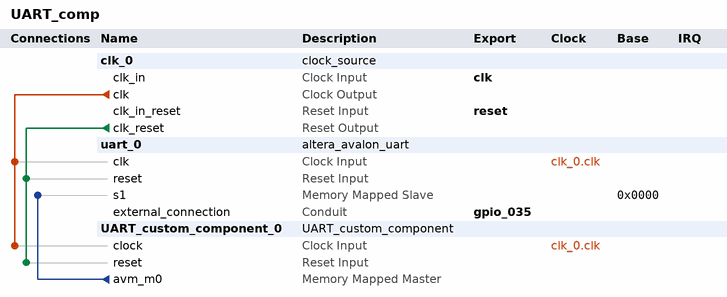
[diagram p0: system contents]
# Platform Designer (Qsys) system UART_comp, Cyclone V 5CSEMA5F31C6
# Parameters at their usual value, and those the tool derives, are not listed.
package require -exact qsys 18.1
create_system UART_comp
set_project_property DEVICE_FAMILY {Cyclone V}
set_project_property DEVICE 5CSEMA5F31C6

add_instance clk_0 clock_source 18.1
set_instance_parameter_value clk_0 clockFrequency 50000000

add_instance uart_0 altera_avalon_uart 18.1
set_instance_parameter_value uart_0 baud 115200
set_instance_parameter_value uart_0 dataBits 8
set_instance_parameter_value uart_0 fixedBaud true
set_instance_parameter_value uart_0 parity NONE
set_instance_parameter_value uart_0 stopBits 1

add_instance UART_custom_component_0 UART_custom_component 1.0

# connections
add_connection clk_0.clk uart_0.clk clock
add_connection clk_0.clk UART_custom_component_0.clock clock
add_connection clk_0.clk_reset uart_0.reset reset
add_connection clk_0.clk_reset UART_custom_component_0.reset reset
add_connection UART_custom_component_0.avm_m0 uart_0.s1 avalon
set_connection_parameter_value UART_custom_component_0.avm_m0/uart_0.s1 baseAddress 0x0000

# exported interfaces
add_interface clk clock sink
set_interface_property clk EXPORT_OF clk_0.clk_in
add_interface gpio_035 conduit end
set_interface_property gpio_035 EXPORT_OF uart_0.external_connection
add_interface reset reset sink
set_interface_property reset EXPORT_OF clk_0.clk_in_reset

set_interconnect_requirement {$system} qsys_mm.clockCrossingAdapter HANDSHAKE
set_interconnect_requirement {$system} qsys_mm.enableEccProtection FALSE
set_interconnect_requirement {$system} qsys_mm.insertDefaultSlave FALSE
set_interconnect_requirement {$system} qsys_mm.maxAdditionalLatency 1

save_system UART_comp.qsys
